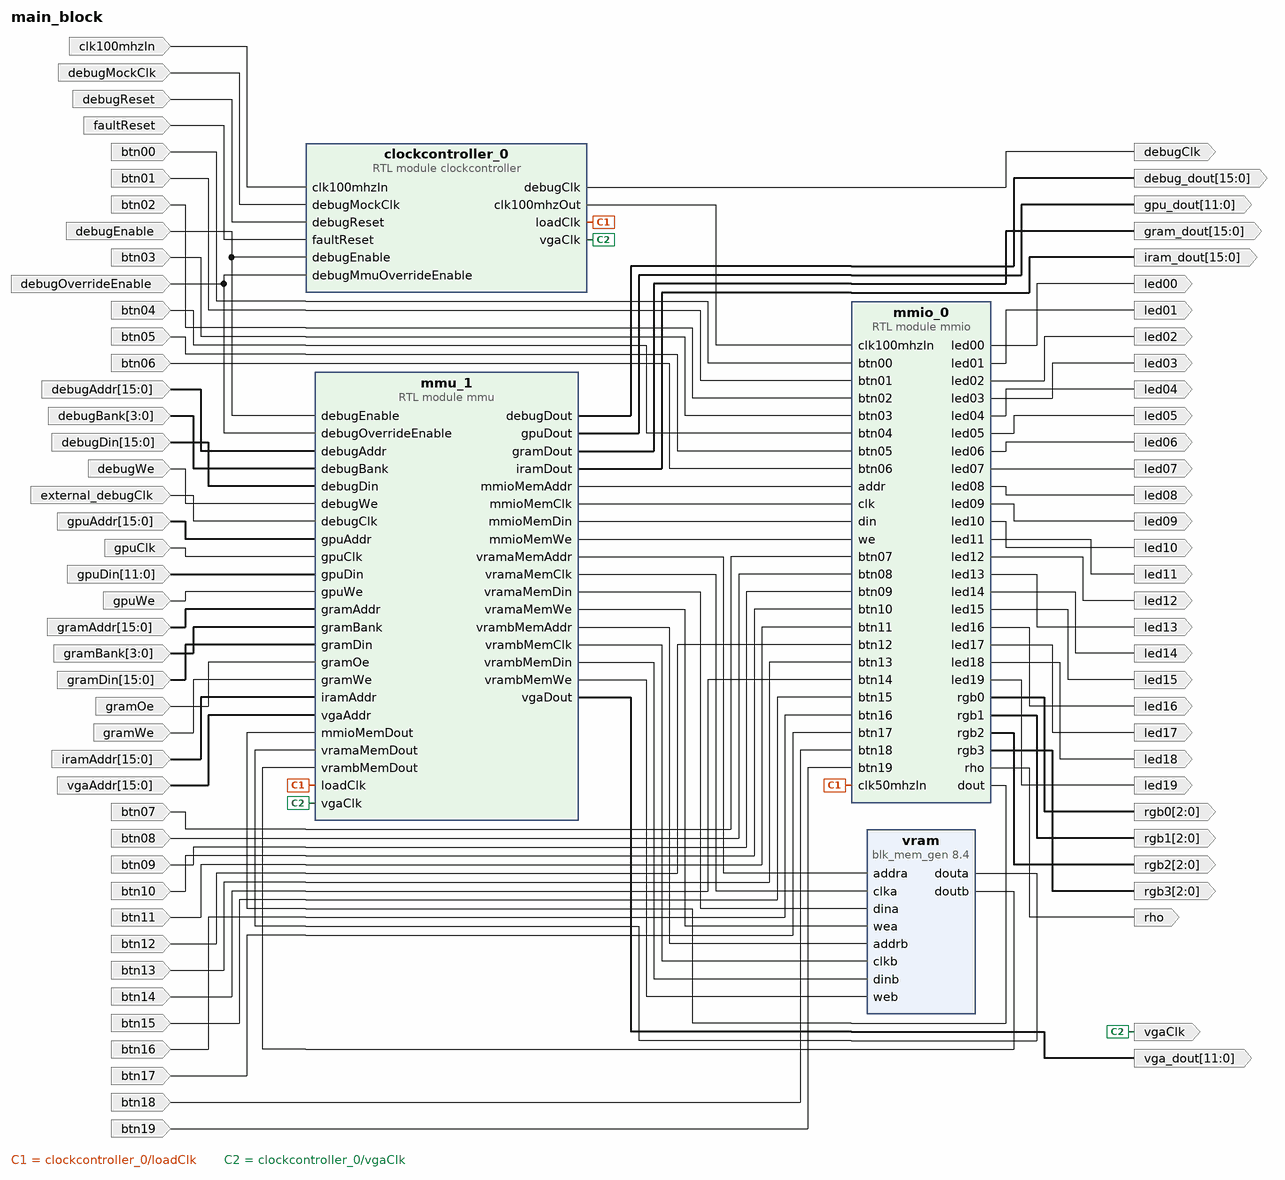
[diagram p0: block diagram of the top level]
# Vivado block design main_block, xc7a35ticsg324-1L, Vivado 2024.1
create_bd_design main_block

create_bd_port -dir O -from 15 -to 0 gram_dout
create_bd_port -dir O -from 15 -to 0 iram_dout
create_bd_port -dir O -from 15 -to 0 debug_dout
create_bd_port -dir O -from 11 -to 0 gpu_dout
create_bd_port -dir O -from 11 -to 0 vga_dout
create_bd_port -dir I btn00
create_bd_port -dir I btn01
create_bd_port -dir I btn02
create_bd_port -dir I btn03
create_bd_port -dir I btn04
create_bd_port -dir I btn05
create_bd_port -dir I btn06
create_bd_port -dir I btn07
create_bd_port -dir I btn08
create_bd_port -dir I btn09
create_bd_port -dir I btn10
create_bd_port -dir I btn11
create_bd_port -dir I btn12
create_bd_port -dir I btn13
create_bd_port -dir I btn14
create_bd_port -dir I btn15
create_bd_port -dir I btn16
create_bd_port -dir I btn17
create_bd_port -dir I btn18
create_bd_port -dir I btn19
create_bd_port -dir O led00
create_bd_port -dir O led01
create_bd_port -dir O led02
create_bd_port -dir O led03
create_bd_port -dir O led04
create_bd_port -dir O led05
create_bd_port -dir O led06
create_bd_port -dir O led07
create_bd_port -dir O led08
create_bd_port -dir O led09
create_bd_port -dir O led10
create_bd_port -dir O led11
create_bd_port -dir O led12
create_bd_port -dir O led13
create_bd_port -dir O led14
create_bd_port -dir O led15
create_bd_port -dir O led16
create_bd_port -dir O led17
create_bd_port -dir O led18
create_bd_port -dir O led19
create_bd_port -dir O -from 2 -to 0 rgb0
create_bd_port -dir O -from 2 -to 0 rgb1
create_bd_port -dir O -from 2 -to 0 rgb2
create_bd_port -dir O -from 2 -to 0 rgb3
create_bd_port -dir O rho
create_bd_port -dir O -type clk vgaClk
create_bd_port -dir O -type clk debugClk
create_bd_port -dir I debugMockClk
create_bd_port -dir I -type clk clk100mhzIn
set_property -dict {CONFIG.FREQ_HZ 100000000} [get_bd_ports clk100mhzIn]
create_bd_port -dir I faultReset
create_bd_port -dir I debugReset
create_bd_port -dir I gramWe
create_bd_port -dir I debugWe
create_bd_port -dir I gpuWe
create_bd_port -dir I -from 15 -to 0 vgaAddr
create_bd_port -dir I -from 15 -to 0 gramAddr
create_bd_port -dir I gramOe
create_bd_port -dir I -from 3 -to 0 gramBank
create_bd_port -dir I -from 15 -to 0 gramDin
create_bd_port -dir I debugEnable
create_bd_port -dir I debugOverrideEnable
create_bd_port -dir I external_debugClk
create_bd_port -dir I -from 15 -to 0 debugAddr
create_bd_port -dir I -from 15 -to 0 iramAddr
create_bd_port -dir I gpuClk
create_bd_port -dir I -from 15 -to 0 debugDin
create_bd_port -dir I -from 3 -to 0 debugBank
create_bd_port -dir I -from 15 -to 0 gpuAddr
create_bd_port -dir I -from 11 -to 0 gpuDin

create_bd_cell -type ip -vlnv xilinx.com:ip:blk_mem_gen:8.4 vram
set_property -dict [list \
  CONFIG.Algorithm Minimum_Area \
  CONFIG.Assume_Synchronous_Clk false \
  CONFIG.Enable_A Always_Enabled \
  CONFIG.Enable_B Always_Enabled \
  CONFIG.Memory_Type True_Dual_Port_RAM \
  CONFIG.Operating_Mode_A READ_FIRST \
  CONFIG.Operating_Mode_B READ_FIRST \
  CONFIG.Register_PortA_Output_of_Memory_Primitives false \
  CONFIG.Register_PortB_Output_of_Memory_Primitives false \
  CONFIG.Use_Byte_Write_Enable false \
  CONFIG.Use_RSTA_Pin false \
  CONFIG.Use_RSTB_Pin false \
  CONFIG.Write_Depth_A 65535 \
  CONFIG.Write_Width_A 12 \
  CONFIG.use_bram_block Stand_Alone \
] [get_bd_cells vram]
create_bd_cell -type module -reference mmio mmio_0
create_bd_cell -type module -reference clockcontroller clockcontroller_0
create_bd_cell -type module -reference mmu mmu_1

# ---- connections ----

connect_bd_net -net btn00_1 [get_bd_ports btn00] [get_bd_pins mmio_0/btn00]
connect_bd_net -net btn01_1 [get_bd_ports btn01] [get_bd_pins mmio_0/btn01]
connect_bd_net -net btn02_1 [get_bd_ports btn02] [get_bd_pins mmio_0/btn02]
connect_bd_net -net btn03_1 [get_bd_ports btn03] [get_bd_pins mmio_0/btn03]
connect_bd_net -net btn04_1 [get_bd_ports btn04] [get_bd_pins mmio_0/btn04]
connect_bd_net -net btn05_1 [get_bd_ports btn05] [get_bd_pins mmio_0/btn05]
connect_bd_net -net btn06_1 [get_bd_ports btn06] [get_bd_pins mmio_0/btn06]
connect_bd_net -net btn07_1 [get_bd_ports btn07] [get_bd_pins mmio_0/btn07]
connect_bd_net -net btn08_1 [get_bd_ports btn08] [get_bd_pins mmio_0/btn08]
connect_bd_net -net btn09_1 [get_bd_ports btn09] [get_bd_pins mmio_0/btn09]
connect_bd_net -net btn10_1 [get_bd_ports btn10] [get_bd_pins mmio_0/btn10]
connect_bd_net -net btn11_1 [get_bd_ports btn11] [get_bd_pins mmio_0/btn11]
connect_bd_net -net btn12_1 [get_bd_ports btn12] [get_bd_pins mmio_0/btn12]
connect_bd_net -net btn13_1 [get_bd_ports btn13] [get_bd_pins mmio_0/btn13]
connect_bd_net -net btn14_1 [get_bd_ports btn14] [get_bd_pins mmio_0/btn14]
connect_bd_net -net btn15_1 [get_bd_ports btn15] [get_bd_pins mmio_0/btn15]
connect_bd_net -net btn16_1 [get_bd_ports btn16] [get_bd_pins mmio_0/btn16]
connect_bd_net -net btn17_1 [get_bd_ports btn17] [get_bd_pins mmio_0/btn17]
connect_bd_net -net btn18_1 [get_bd_ports btn18] [get_bd_pins mmio_0/btn18]
connect_bd_net -net btn19_1 [get_bd_ports btn19] [get_bd_pins mmio_0/btn19]
connect_bd_net [get_bd_ports clk100mhzIn] [get_bd_pins clockcontroller_0/clk100mhzIn]
connect_bd_net [get_bd_pins clockcontroller_0/clk100mhzOut] [get_bd_pins mmio_0/clk100mhzIn]
connect_bd_net [get_bd_pins clockcontroller_0/debugClk] [get_bd_ports debugClk]
connect_bd_net -net clockcontroller_0_load_clk [get_bd_pins clockcontroller_0/loadClk] [get_bd_pins mmio_0/clk50mhzIn] [get_bd_pins mmu_1/loadClk]
connect_bd_net [get_bd_pins clockcontroller_0/vgaClk] [get_bd_ports vgaClk] [get_bd_pins mmu_1/vgaClk]
connect_bd_net [get_bd_ports debugAddr] [get_bd_pins mmu_1/debugAddr]
connect_bd_net [get_bd_ports debugBank] [get_bd_pins mmu_1/debugBank]
connect_bd_net [get_bd_ports debugDin] [get_bd_pins mmu_1/debugDin]
connect_bd_net [get_bd_ports debugMockClk] [get_bd_pins clockcontroller_0/debugMockClk]
connect_bd_net [get_bd_ports debugReset] [get_bd_pins clockcontroller_0/debugReset]
connect_bd_net [get_bd_ports debugWe] [get_bd_pins mmu_1/debugWe]
connect_bd_net -net debug_enable_1 [get_bd_ports debugEnable] [get_bd_pins clockcontroller_0/debugEnable] [get_bd_pins mmu_1/debugEnable]
connect_bd_net -net debug_override_enable_1 [get_bd_ports debugOverrideEnable] \
  [get_bd_pins clockcontroller_0/debugMmuOverrideEnable] [get_bd_pins mmu_1/debugOverrideEnable]
connect_bd_net [get_bd_ports external_debugClk] [get_bd_pins mmu_1/debugClk]
connect_bd_net [get_bd_ports faultReset] [get_bd_pins clockcontroller_0/faultReset]
connect_bd_net [get_bd_ports gpuAddr] [get_bd_pins mmu_1/gpuAddr]
connect_bd_net [get_bd_ports gpuClk] [get_bd_pins mmu_1/gpuClk]
connect_bd_net [get_bd_ports gpuDin] [get_bd_pins mmu_1/gpuDin]
connect_bd_net [get_bd_ports gpuWe] [get_bd_pins mmu_1/gpuWe]
connect_bd_net [get_bd_ports gramAddr] [get_bd_pins mmu_1/gramAddr]
connect_bd_net [get_bd_ports gramBank] [get_bd_pins mmu_1/gramBank]
connect_bd_net [get_bd_ports gramDin] [get_bd_pins mmu_1/gramDin]
connect_bd_net [get_bd_ports gramOe] [get_bd_pins mmu_1/gramOe]
connect_bd_net [get_bd_ports gramWe] [get_bd_pins mmu_1/gramWe]
connect_bd_net [get_bd_ports iramAddr] [get_bd_pins mmu_1/iramAddr]
connect_bd_net [get_bd_pins mmio_0/dout] [get_bd_pins mmu_1/mmioMemDout]
connect_bd_net [get_bd_pins mmio_0/led00] [get_bd_ports led00]
connect_bd_net [get_bd_pins mmio_0/led01] [get_bd_ports led01]
connect_bd_net [get_bd_pins mmio_0/led02] [get_bd_ports led02]
connect_bd_net [get_bd_pins mmio_0/led03] [get_bd_ports led03]
connect_bd_net [get_bd_pins mmio_0/led04] [get_bd_ports led04]
connect_bd_net [get_bd_pins mmio_0/led05] [get_bd_ports led05]
connect_bd_net [get_bd_pins mmio_0/led06] [get_bd_ports led06]
connect_bd_net [get_bd_pins mmio_0/led07] [get_bd_ports led07]
connect_bd_net [get_bd_pins mmio_0/led08] [get_bd_ports led08]
connect_bd_net [get_bd_pins mmio_0/led09] [get_bd_ports led09]
connect_bd_net [get_bd_pins mmio_0/led10] [get_bd_ports led10]
connect_bd_net [get_bd_pins mmio_0/led11] [get_bd_ports led11]
connect_bd_net [get_bd_pins mmio_0/led12] [get_bd_ports led12]
connect_bd_net [get_bd_pins mmio_0/led13] [get_bd_ports led13]
connect_bd_net [get_bd_pins mmio_0/led14] [get_bd_ports led14]
connect_bd_net [get_bd_pins mmio_0/led15] [get_bd_ports led15]
connect_bd_net [get_bd_pins mmio_0/led16] [get_bd_ports led16]
connect_bd_net [get_bd_pins mmio_0/led17] [get_bd_ports led17]
connect_bd_net [get_bd_pins mmio_0/led18] [get_bd_ports led18]
connect_bd_net [get_bd_pins mmio_0/led19] [get_bd_ports led19]
connect_bd_net [get_bd_pins mmio_0/rgb0] [get_bd_ports rgb0]
connect_bd_net [get_bd_pins mmio_0/rgb1] [get_bd_ports rgb1]
connect_bd_net [get_bd_pins mmio_0/rgb2] [get_bd_ports rgb2]
connect_bd_net [get_bd_pins mmio_0/rgb3] [get_bd_ports rgb3]
connect_bd_net [get_bd_pins mmio_0/rho] [get_bd_ports rho]
connect_bd_net [get_bd_pins mmu_1/debugDout] [get_bd_ports debug_dout]
connect_bd_net [get_bd_pins mmu_1/gpuDout] [get_bd_ports gpu_dout]
connect_bd_net [get_bd_pins mmu_1/gramDout] [get_bd_ports gram_dout]
connect_bd_net [get_bd_pins mmu_1/iramDout] [get_bd_ports iram_dout]
connect_bd_net [get_bd_pins mmu_1/mmioMemAddr] [get_bd_pins mmio_0/addr]
connect_bd_net [get_bd_pins mmu_1/mmioMemClk] [get_bd_pins mmio_0/clk]
connect_bd_net [get_bd_pins mmu_1/mmioMemDin] [get_bd_pins mmio_0/din]
connect_bd_net [get_bd_pins mmu_1/mmioMemWe] [get_bd_pins mmio_0/we]
connect_bd_net [get_bd_pins mmu_1/vgaDout] [get_bd_ports vga_dout]
connect_bd_net [get_bd_pins mmu_1/vramaMemAddr] [get_bd_pins vram/addra]
connect_bd_net [get_bd_pins mmu_1/vramaMemClk] [get_bd_pins vram/clka]
connect_bd_net [get_bd_pins mmu_1/vramaMemDin] [get_bd_pins vram/dina]
connect_bd_net [get_bd_pins mmu_1/vramaMemWe] [get_bd_pins vram/wea]
connect_bd_net [get_bd_pins mmu_1/vrambMemAddr] [get_bd_pins vram/addrb]
connect_bd_net [get_bd_pins mmu_1/vrambMemClk] [get_bd_pins vram/clkb]
connect_bd_net [get_bd_pins mmu_1/vrambMemDin] [get_bd_pins vram/dinb]
connect_bd_net [get_bd_pins mmu_1/vrambMemWe] [get_bd_pins vram/web]
connect_bd_net [get_bd_ports vgaAddr] [get_bd_pins mmu_1/vgaAddr]
connect_bd_net [get_bd_pins vram/douta] [get_bd_pins mmu_1/vramaMemDout]
connect_bd_net [get_bd_pins vram/doutb] [get_bd_pins mmu_1/vrambMemDout]

validate_bd_design
save_bd_design
